# Altium schematic sheet DDR3.SchDoc
size Tabloid; SheetNumber: 5; SheetTotal: 12
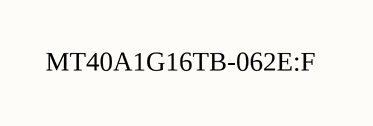
[diagram p0: DDR3.SchDoc]

## Notes on the sheet
- MT40A1G16TB-062E:F